# Altium schematic sheet custom_line_V1_mux2.SchDoc
size 209 x 297 mm
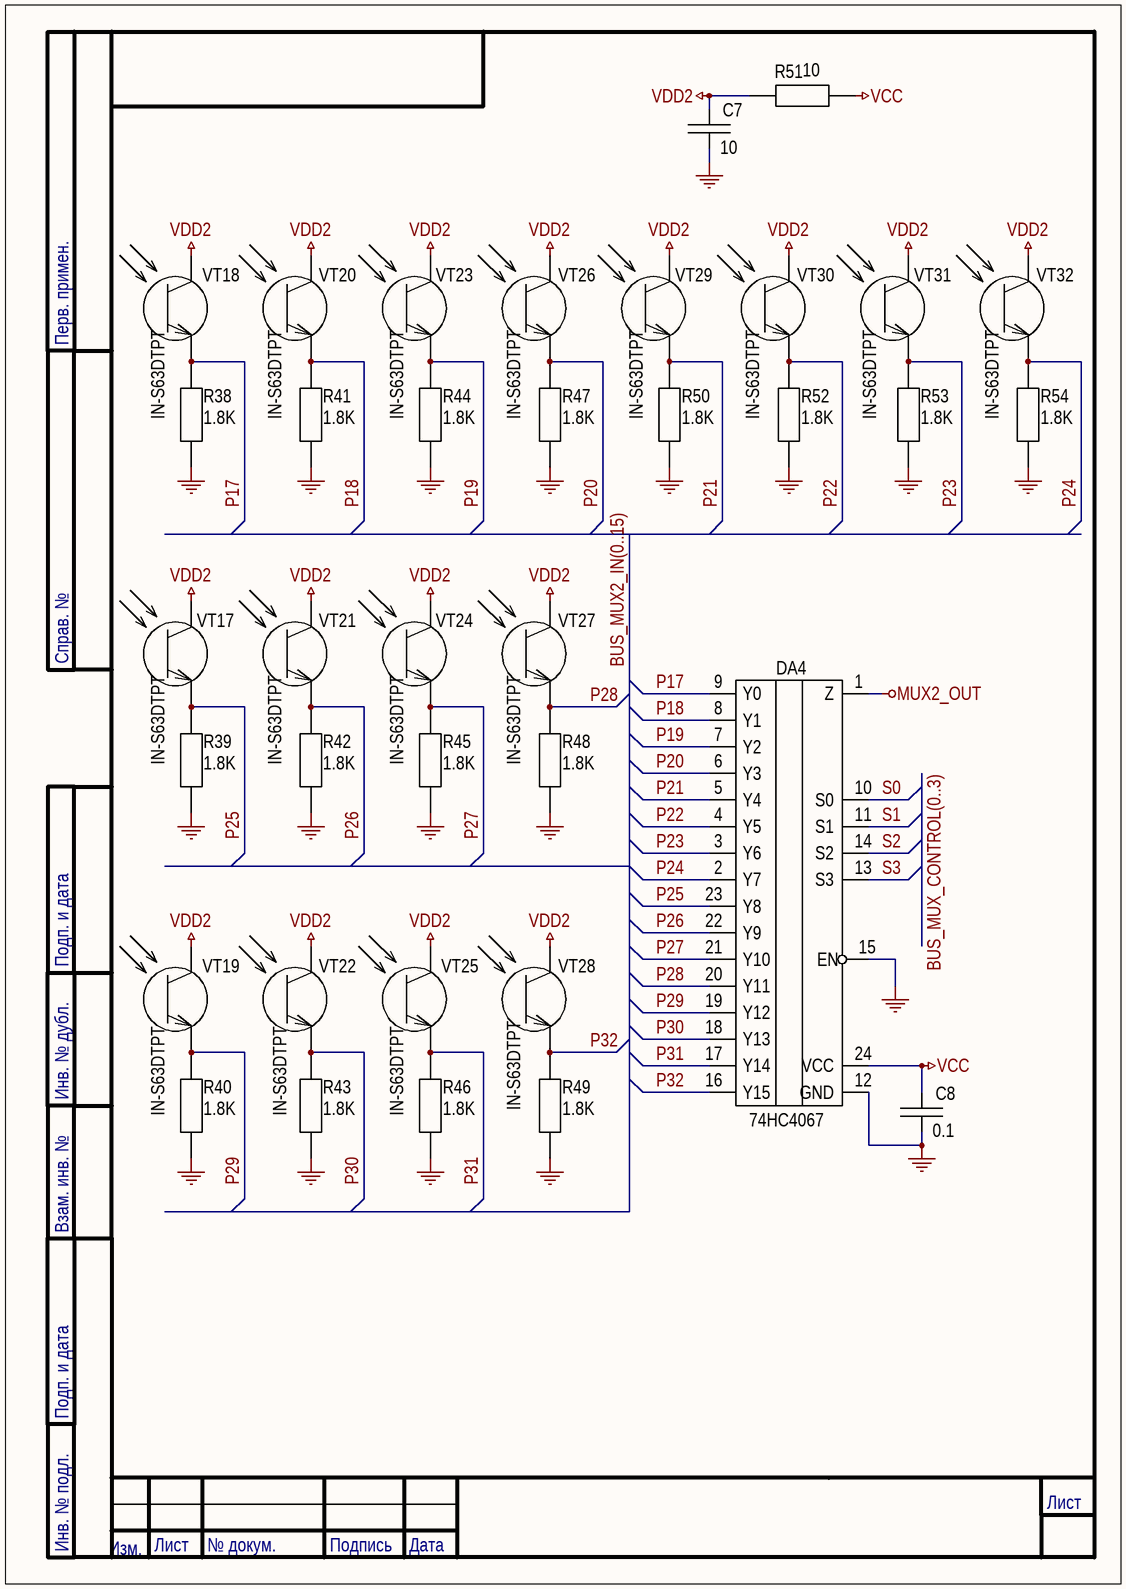
[diagram p0: custom_line_V1_mux2.SchDoc]

## Parts
C7  10  [CC_0805]
C8  0.1  [CC_0603]
DA4  74HC4067  [TSSOP-24]
R38  1.8K  [RC_0603_SMALL]
R39  1.8K  [RC_0603_SMALL]
R40  1.8K  [RC_0603_SMALL]
R41  1.8K  [RC_0603_SMALL]
R42  1.8K  [RC_0603_SMALL]
R43  1.8K  [RC_0603_SMALL]
R44  1.8K  [RC_0603_SMALL]
R45  1.8K  [RC_0603_SMALL]
R46  1.8K  [RC_0603_SMALL]
R47  1.8K  [RC_0603_SMALL]
R48  1.8K  [RC_0603_SMALL]
R49  1.8K  [RC_0603_SMALL]
R50  1.8K  [RC_0603_SMALL]
R51  10  [RC_0603_SMALL]
R52  1.8K  [RC_0603_SMALL]
R53  1.8K  [RC_0603_SMALL]
R54  1.8K  [RC_0603_SMALL]
VT17  IN-S63DTPT  [LED_0603]
VT18  IN-S63DTPT  [LED_0603]
VT19  IN-S63DTPT  [LED_0603]
VT20  IN-S63DTPT  [LED_0603]
VT21  IN-S63DTPT  [LED_0603]
VT22  IN-S63DTPT  [LED_0603]
VT23  IN-S63DTPT  [LED_0603]
VT24  IN-S63DTPT  [LED_0603]
VT25  IN-S63DTPT  [LED_0603]
VT26  IN-S63DTPT  [LED_0603]
VT27  IN-S63DTPT  [LED_0603]
VT28  IN-S63DTPT  [LED_0603]
VT29  IN-S63DTPT  [LED_0603]
VT30  IN-S63DTPT  [LED_0603]
VT31  IN-S63DTPT  [LED_0603]
VT32  IN-S63DTPT  [LED_0603]

## Nets
GND: C7.1 C8.1 DA4.12(GND) DA4.15(EN) R38.1 R39.1 R40.1 R41.1 R42.1 R43.1 R44.1 R45.1 R46.1 R47.1 R48.1 R49.1 R50.1 R52.1 R53.1 R54.1
MUX2_OUT: DA4.1(Z)
VCC: C8.2 DA4.24(VCC) R51.1
VDD2: C7.2 R51.2 VT17.1(C) VT18.1(C) VT19.1(C) VT20.1(C) VT21.1(C) VT22.1(C) VT23.1(C) VT24.1(C) VT25.1(C) VT26.1(C) VT27.1(C) VT28.1(C) VT29.1(C) VT30.1(C) VT31.1(C) VT32.1(C)
P17: DA4.9(Y0) R38.2 VT18.2(E)
P18: DA4.8(Y1) R41.2 VT20.2(E)
P19: DA4.7(Y2) R44.2 VT23.2(E)
P20: DA4.6(Y3) R47.2 VT26.2(E)
P21: DA4.5(Y4) R50.2 VT29.2(E)
P22: DA4.4(Y5) R52.2 VT30.2(E)
P23: DA4.3(Y6) R53.2 VT31.2(E)
P24: DA4.2(Y7) R54.2 VT32.2(E)
P25: DA4.23(Y8) R39.2 VT17.2(E)
P26: DA4.22(Y9) R42.2 VT21.2(E)
P27: DA4.21(Y10) R45.2 VT24.2(E)
P28: DA4.20(Y11) R48.2 VT27.2(E)
P29: DA4.19(Y12) R40.2 VT19.2(E)
P30: DA4.18(Y13) R43.2 VT22.2(E)
P31: DA4.17(Y14) R46.2 VT25.2(E)
P32: DA4.16(Y15) R49.2 VT28.2(E)
S0: DA4.10(S0)
S1: DA4.11(S1)
S2: DA4.14(S2)
S3: DA4.13(S3)

## Buses and harness runs
bus BUS_MUX2_IN(0..15)
bus BUS_MUX_CONTROL(0..3)

## Notes on the sheet
- Перв. примен.
- Справ. №
- Подп. и дата
- Инв. № дубл.
- Взам. инв. №
- Изм.
- Лист
- Инв. № подл.
- № докум.
- Подпись
- Дата

## Library data of the parts
C7 = C: type: CC-0805-106-16V-X7R-10%; value: 10uF
C8 = C: type: CC-0603-B-104-K-50; value: 0.1uF
DA4 = 74HCT4067: 74HC4067PW; type: 74HC4067
R38-R50 R52-R54 = R: power: 0.125W; value: 100K; type: RC-0603-104-5%
R51 = R: power: 0.125W; type: RC-0603-R10-5%; value: 10
VT17-VT32 = phototransistor: Phototransistor (Inolux); type: IN-S63DTPT